# EAGLE design A (EAGLE 7.5.0)
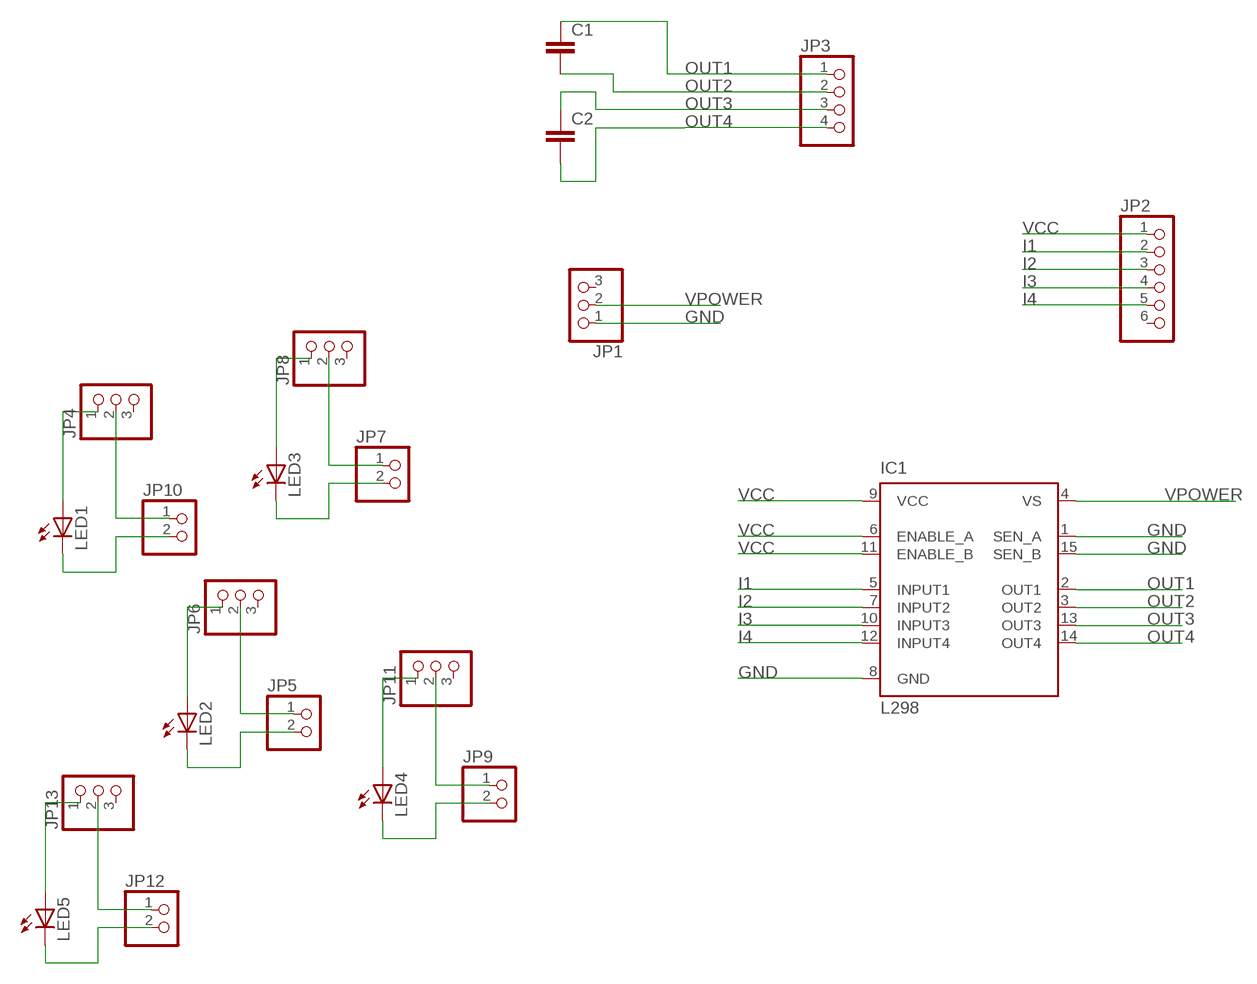
[diagram p0: schematic, sheet 1]

## Parts
C1  C2,5-3  [C2.5-3]
C2  C2,5-3  [C2.5-3]
IC1  L298  [MULTIWATT-15]
JP1  PINHD-1X3  [1X03]
JP2  PINHD-1X6  [1X06]
JP3  PINHD-1X4  [1X04]
JP4  PINHD-1X3  [1X03]
JP5  PINHD-1X2  [1X02]
JP6  PINHD-1X3  [1X03]
JP7  PINHD-1X2  [1X02]
JP8  PINHD-1X3  [1X03]
JP9  PINHD-1X2  [1X02]
JP10  PINHD-1X2  [1X02]
JP11  PINHD-1X3  [1X03]
JP12  PINHD-1X2  [1X02]
JP13  PINHD-1X3  [1X03]
LED1  LED5MM  [LED5MM]
LED2  LED5MM  [LED5MM]
LED3  LED5MM  [LED5MM]
LED4  LED5MM  [LED5MM]
LED5  LED5MM  [LED5MM]

## Nets
GND: IC1.1(SEN_A) IC1.8(GND) IC1.15(SEN_B) JP1.1
I1: IC1.5(INPUT1) JP2.2
I2: IC1.7(INPUT2) JP2.3
I3: IC1.10(INPUT3) JP2.4
I4: IC1.12(INPUT4) JP2.5
N$2: JP10.2 LED1.K(C)
N$3: JP4.2 JP10.1
N$5: JP4.1 LED1.A
N$6: JP5.2 LED2.K(C)
N$7: JP5.1 JP6.2
N$8: JP6.1 LED2.A
N$9: JP7.2 LED3.K(C)
N$10: JP7.1 JP8.2
N$11: JP8.1 LED3.A
N$14: JP9.2 LED4.K(C)
N$15: JP9.1 JP11.2
N$16: JP11.1 LED4.A
N$17: JP12.2 LED5.K(C)
N$18: JP12.1 JP13.2
N$19: JP13.1 LED5.A
OUT1: C1.1 IC1.2(OUT1) JP3.1
OUT2: C1.2 IC1.3(OUT2) JP3.2
OUT3: C2.1 IC1.13(OUT3) JP3.3
OUT4: C2.2 IC1.14(OUT4) JP3.4
VCC: IC1.6(ENABLE_A) IC1.9(VCC) IC1.11(ENABLE_B) JP2.1
VPOWER: IC1.4(VS) JP1.2
Unconnected: JP1.3 JP2.6 JP4.3 JP6.3 JP8.3 JP11.3 JP13.3

## Library data of the parts
C1 C2 = capacitor-wima:C: CAPACITOR naming: grid - package width
IC1 = st-microelectronics:L298: DUAL FULL-BRIDGE DRIVER; MPN: L298N; OC_FARNELL: 1589425; OC_NEWARK: 32M1527
JP1 JP4 JP6 JP8 JP11 JP13 = pinhead:PINHD-1X3: PIN HEADER
JP2 = pinhead:PINHD-1X6: PIN HEADER
JP3 = pinhead:PINHD-1X4: PIN HEADER
JP5 JP7 JP9 JP10 JP12 = pinhead:PINHD-1X2: PIN HEADER
LED1-LED5 = led:LED: LED OSRAM: - CHIPLED LG R971, LG N971, LY N971, LG Q971, LY Q971, LO R971, LY R971 LH N974, LH R974 LS Q976, LO Q976, LY Q976 LO Q996 - Hyper CHIPLED LW Q18S LB Q993, LB Q99A, LB R99A - SideLED LS A670, LO A670, LY A670, LG A670, LP A670 LB A673, LV A673, LT A673, LW A673 LH A674 LY A675 LS A676, LA A676, LO A676, LY A676, LW A676 LS A679, LY A679, LG A679 - Hyper Micro SIDELED® LS Y876, LA Y876, LO Y876, LY Y876 LT Y87S - SmartLED LW L88C, LW L88S LB L89C, LB L89S, LG L890 LS L89K, LO L89K, LY L89K LS L896, LA L896, LO L896, LY L896 - TOPLED LS T670, LO T670, LY T670, LG T670, LP T670 LSG T670, LSP T670, LSY T670, LOP T670, LYG T670 LG T671, LOG T671, LSG T671 LB T673, LV T673, LT T673, LW T673 LH T674 LS T676, LA T676, LO T676, LY T676, LB T676, LH T676, LSB T676, LW T676 LB T67C, LV T67C, LT T67C, LS T67K, LO T67K, LY T67K, LW E67C LS E67B, LA E67B, LO E67B, LY E67B, LB E67C, LV E67C, LT E67C LW T67C LS T679, LY T679, LG T679 LS T770, LO T770, LY T770, LG T770, LP T770 LB T773, LV T773, LT T773, LW T773 LH T774 LS E675, LA E675, LY E675, LS T675 LS T776, LA T776, LO T776, LY T776, LB T776 LHGB T686 LT T68C, LB T68C - Hyper Mini TOPLED® LB M676 - Mini TOPLED Santana® LG M470 LS M47K, LO M47K, LY M47K Source: http://www.osram.convergy.de LUXEON: - LUMILED® LXK2-PW12-R00, LXK2-PW12-S00, LXK2-PW14-U00, LXK2-PW14-V00 LXK2-PM12-R00, LXK2-PM12-S00, LXK2-PM14-U00 LXK2-PE12-Q00, LXK2-PE12-R00, LXK2-PE12-S00, LXK2-PE14-T00, LXK2-PE14-U00 LXK2-PB12-K00, LXK2-PB12-L00, LXK2-PB12-M00, LXK2-PB14-N00, LXK2-PB14-P00, LXK2-PB14-Q00 LXK2-PR12-L00, LXK2-PR12-M00, LXK2-PR14-Q00, LXK2-PR14-R00 LXK2-PD12-Q00, LXK2-PD12-R00, LXK2-PD12-S00 LXK2-PH12-R00, LXK2-PH12-S00 LXK2-PL12-P00, LXK2-PL12-Q00, LXK2-PL12-R00 Source: www.luxeon.com KINGBRIGHT: KA-3528ASYC Source: www.kingbright.com

## Net classes
0 default: width 0.508 mm

## Board
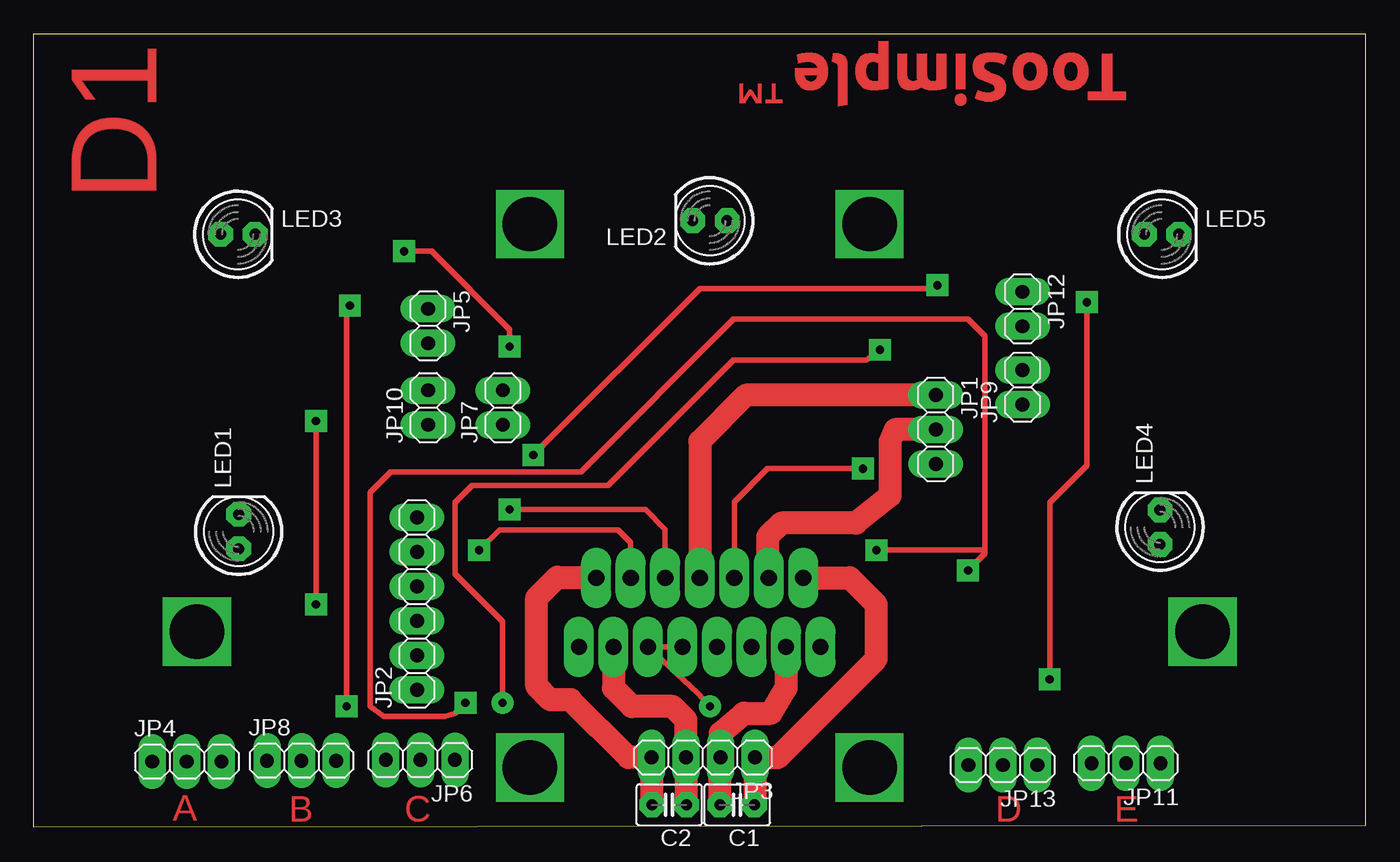
[diagram p1: board, top side]
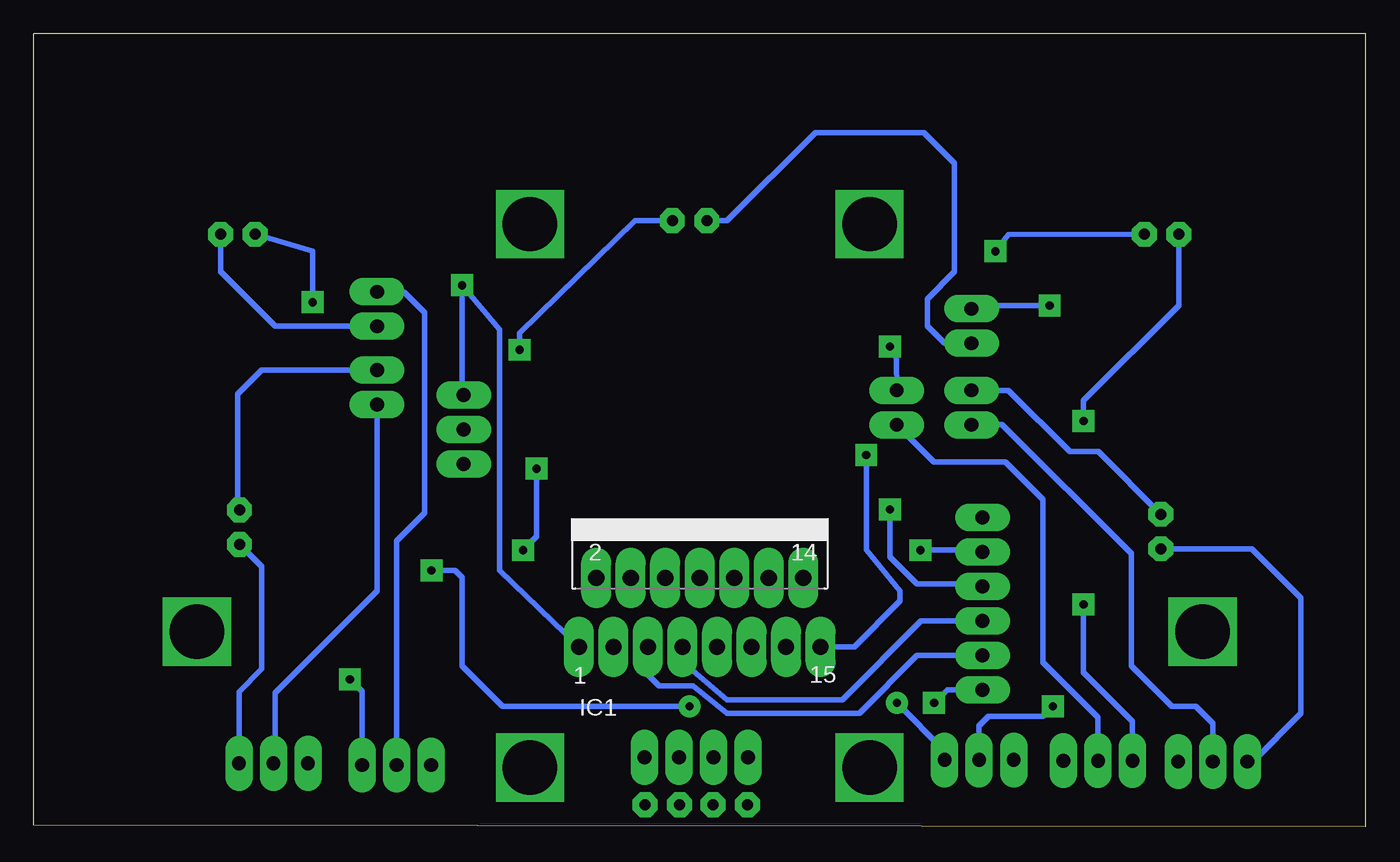
[diagram p2: board, bottom side, seen from below]

Size 98 x 58.38 mm. Coordinates in mm from the lower left corner, seen from the top.
Outline: 0,0 98,0.12 98,58.38 0,58.38 0,0
Copper layers (1*16): Top 0.035mm / dielectric 1.5mm / Bottom 0.035mm
Design rules "default *": minimum track width 10mil, minimum drill 24mil, track to track 30mil, track to pad 30mil, pad to pad 30mil, via to via 30mil, smd to smd 8mil, copper to edge 40mil, drill to drill 8mil, minimum pad ring 20mil, minimum via ring 20mil, stop-mask expansion 4mil, vias tented up to drill 0mil, thermal gap 10mil

### Footprints (pad centres in the part's own frame; a part is rotated, then mirrored left to right if it is on the bottom)
C2.5-3 = drill 0.813 pad 1.6 octagon: 1 -1.27,0; 2 1.27,0
MULTIWATT-15 = drill 1.2 long: 1 -8.89,-7.62; 2 -7.62,-2.54; 3 -6.35,-7.62; 4 -5.08,-2.54; 5 -3.81,-7.62; 6 -2.54,-2.54; 7 -1.27,-7.62; 8 0,-2.54; 9 1.27,-7.62; 10 2.54,-2.54; 11 3.81,-7.62; 12 5.08,-2.54; 13 6.35,-7.62; 14 7.62,-2.54; 15 8.89,-7.62
1X03 = drill 1.016 long: 1 -2.54,0; 2 0,0; 3 2.54,0
1X06 = drill 1.016 long: 1 -6.35,0; 2 -3.81,0; 3 -1.27,0; 4 1.27,0; 5 3.81,0; 6 6.35,0
1X04 = drill 1.016 long: 1 -3.81,0; 2 -1.27,0; 3 1.27,0; 4 3.81,0
1X02 = drill 1.016 long: 1 -1.27,0; 2 1.27,0
LED5MM = drill 0.813 octagon: A -1.27,0; K 1.27,0

### Placement (x,y rotation side)
C1  51.75,1.62 180 top
C2  46.75,1.62 180 top
IC1  49,20.88 0 bottom
JP1  66.38,29.25 270 top
JP2  28.19,16.44 90 top
JP3  49.25,5.12 180 top
JP4  11.25,4.81 0 top
JP5  29,36.88 270 top
JP6  28.44,4.94 180 top
JP7  34.5,30.88 90 top
JP8  19.69,4.88 0 top
JP9  72.75,32.38 90 top
JP10  29,30.88 90 top
JP11  80.38,4.69 180 top
JP12  72.75,38.12 270 top
JP13  71.31,4.56 180 top
LED1  15.06,21.75 90 top
LED2  49.75,44.62 180 top
LED3  15,43.62 0 top
LED4  82.88,22.06 90 top
LED5  83,43.62 0 top

### Tracks (layer width: path | path; a pad name or v marks a point on that pad's centre or on a via)
GND  (via drill 0.6)
  Top 0.406: v36.75,27.38 49,39.62 66.25,39.62 v66.5,39.88
  Top 1.676: JP1.1 52.41,31.79 49,28.38 IC1.8
  Bottom 0.406: IC1.15 37.62,13.25 34.25,16.62 34.25,17.38 36.75,20.38 v36.75,27.38 | JP1.1 66.5,31.91 v66.5,39.88 63.75,36.62 63.75,18.88 IC1.1
I1
  Bottom 0.406: IC1.5 52.81,11.18 52,10.38 49.5,10.38 47,8.38 37.25,8.38 33,12.62 JP2.2
I2
  Bottom 0.406: IC1.7 50.27,12.14 47,9.38 38.5,9.38 32.71,15.17 JP2.3
I3  (via drill 0.6)
  Top 0.406: IC1.10 46.46,21.91 45,23.38 v35,23.38
  Bottom 0.406: v35,23.38 35,19.88 33,17.88 28.35,17.88 JP2.4
I4  (via drill 0.6)
  Top 0.406: IC1.12 43.92,20.95 43,21.88 34.25,21.88 v32.75,20.38
  Bottom 0.406: v32.75,20.38 28.31,20.38 JP2.5
N$1  (via drill 4 pad 2.54)
  other vias: 61.5,44.38 61.5,44.38
N$2
  Bottom 0.406: JP10.2 26.27,32.15 21.75,27.62 19.67,27.62 LED1.K
N$3
  Bottom 0.406: JP10.1 28.98,29.62 26.75,29.62 17.25,20.12 17.25,11.88 14.25,8.88 12.5,8.88 11.25,7.62 JP4.2
N$4  (via drill 4 pad 2.54)
  other vias: 61.5,4.38
N$5
  Bottom 0.406: JP4.1 8.31,4.81 4.75,8.38 4.75,16.88 8.36,20.48 LED1.A
N$6
  Bottom 0.406: JP5.2 30.98,35.6 32.25,36.88 32.25,38.88 30.25,40.88 30.25,48.88 32.5,51.12 40.5,51.12 47,44.62 LED2.K
N$7  (via drill 0.6)
  Top 0.406: v23,8.88 23,38.12 v23.25,38.38
  Bottom 0.406: JP6.2 28.44,7.44 27.75,8.12 23.75,8.12 v23,8.88 | v23.25,38.38 28.77,38.38 JP5.1
N$8  (via drill 0.6)
  Top 0.406: v34.5,9.12 34.5,15.12 31,18.62 31,23.88 32.25,25.12 42.25,25.12 51.5,34.38 61.25,34.38 v62.25,35.12
  Bottom 0.406: JP6.1 30.98,5.6 v34.5,9.12 | v62.25,35.12 62.25,36.38 53.75,44.62 LED2.A
N$9  (via drill 0.6)
  Top 0.406: v35,35.38 35,36.62 29.25,42.38 v27.25,42.38
  Bottom 0.406: JP7.2 34.52,34.4 v35,35.38 | LED3.K 26.27,43.6 v27.25,42.38
N$10
  Bottom 0.406: JP8.2 19.69,8.06 23.75,12.12 23.75,24.12 26.5,26.88 31.77,26.88 JP7.1
N$11  (via drill 0.6)
  Top 0.406: v20.75,16.38 v20.75,29.88
  Bottom 0.406: v20.75,29.88 20.75,31.38 13.75,38.38 13.75,41.35 LED3.A | JP8.1 17.15,7.77 20.75,11.38 v20.75,16.38
N$12  (via drill 4 pad 2.54)
  other vias: 36.5,44.38
N$13  (via drill 4 pad 2.54)
  other vias: 36.5,4.38
N$14
  Bottom 0.406: JP9.2 81.23,33.65 83,31.88 83,23.46 LED4.K
N$15
  Bottom 0.406: JP9.1 72.75,17.38 80.25,9.88 80.25,5.06 JP11.2
N$16
  Bottom 0.406: JP11.1 82.92,9.96 81.25,11.62 81.25,19.17 LED4.A
N$17
  Bottom 0.406: LED5.K 84.27,40.9 80.25,36.88 72.77,36.88 JP12.2
N$18
  Bottom 0.406: JP13.2 71.31,21.06 69.25,23.12 69.25,37.88 70.75,39.38 72.73,39.38 JP12.1
N$19  (via drill 0.6)
  Top 0.406: v74.75,10.88 74.75,23.88 77.5,26.62 v77.5,38.62
  Bottom 0.406: JP13.1 73.85,9.98 v74.75,10.88 | v77.5,38.62 77.5,42.4 LED5.A
N$20  (via drill 4)
  other vias: 12,14.38
N$21  (via drill 4)
  other vias: 86,14.38
OUT1
  Top 1.676: IC1.2 60.04,18.34 62,16.38 62,12.38 54.75,5.12 JP3.1 53.06,1.66 C1.1
OUT2
  Top 1.676: IC1.3 55.35,10.23 54.25,8.38 52.25,8.38 50.52,6.89 JP3.2 50.48,5.09 C1.2
OUT3
  Top 1.676: IC1.13 42.65,10.23 44,8.88 47,8.88 47.98,7.89 JP3.3 47.98,1.66 C2.1
OUT4
  Top 1.676: IC1.14 41.34,18.38 38.5,18.38 37,16.88 37,10.38 38,9.38 39.5,9.38 43.75,5.12 JP3.4 45.48,5.09 C2.2
VCC  (via drill 0.6)
  Top 0.406: IC1.6 51.54,23.91 54,26.38 v61,26.38 | v49.75,8.88 48.82,9.88 IC1.11 IC1.9 | v31.75,9.12 31,8.38 30.25,8.12 25.75,8.12 24.75,8.88 24.75,24.62 26.25,26.12 40.25,26.12 51.5,37.38 68.75,37.38 70,36.12 70,20.38 | 70,20.38 70,20.12 v68.75,18.88 | v62,20.38 70,20.38
  Bottom 0.406: v49.75,8.88 63.5,8.88 66.5,11.88 66.5,18.38 67,18.88 v68.75,18.88 | JP2.1 30.79,10.09 v31.75,9.12 | v61,26.38 61,21.38 v62,20.38
VPOWER
  Top 1.676: JP1.2 63.38,29.25 63,28.38 63,24.38 60.5,22.38 55,22.38 54,21.38 54,18.41 IC1.4
(copper drawn outside any net)
  shapes: Top area x1172

### Text on the board
Top: D1 | A | B | C | D | E | /home/newtonis/Downloads/toosimple (1).bmp